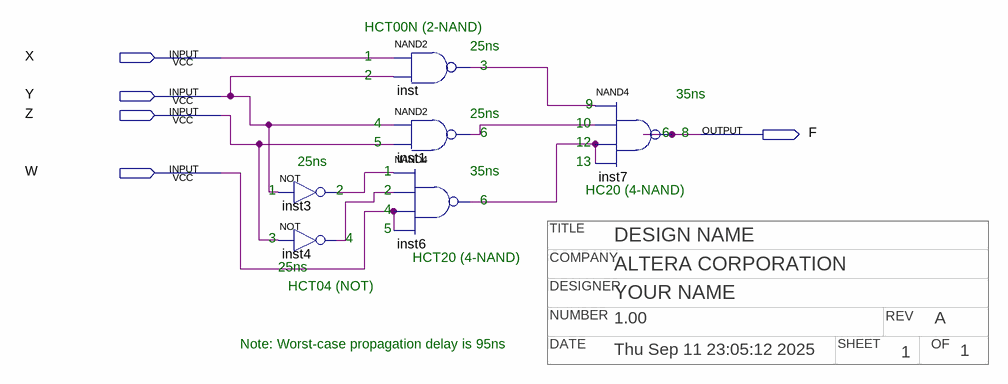
[diagram p0: schematic sheet]
// Quartus schematic Lab03_BDF_FILE.bdf as structural Verilog: 6 symbols, 5 pins
// Title block: TITLE: DESIGN NAME; COMPANY: ALTERA CORPORATION; DESIGNER: YOUR NAME; NUMBER: 1.00; REV: A; DATE: Thu Sep 11 23:05:12 2025; SHEET: 1; OF: 1
module Lab03_BDF_FILE (
  input  X,
  input  Y,
  input  Z,
  input  W,
  output F
);

  wire inst1_out, inst3_out, inst4_out, inst6_out, inst_out;

  not inst3 (inst3_out, Y);
  not inst4 (inst4_out, Z);
  nand inst (inst_out, X, Y);
  nand inst1 (inst1_out, Y, Z);
  nand inst6 (inst6_out, inst3_out, inst4_out, W, W);
  nand inst7 (F, inst_out, inst1_out, inst6_out, inst6_out);

  // Notes on the sheet:
  //   HCT00N (2-NAND)
  //   25ns
  //   1
  //   3
  //   2
  //    35ns
  //   9
  //   25ns
  //   4
  //   10
  //   6
  //   6
  //   8
  //   5
  //   12
  //   25ns
  //   13
  //   1
  //   35ns
  //   1
  //   2
  //   2
  //   HC20 (4-NAND)
  //   6
  //   4
  //   5
  //   3
  //   4
  //   HCT20 (4-NAND)
  //   25ns
  //   HCT04 (NOT)
  //   Note: Worst-case propagation delay is 95ns
endmodule
